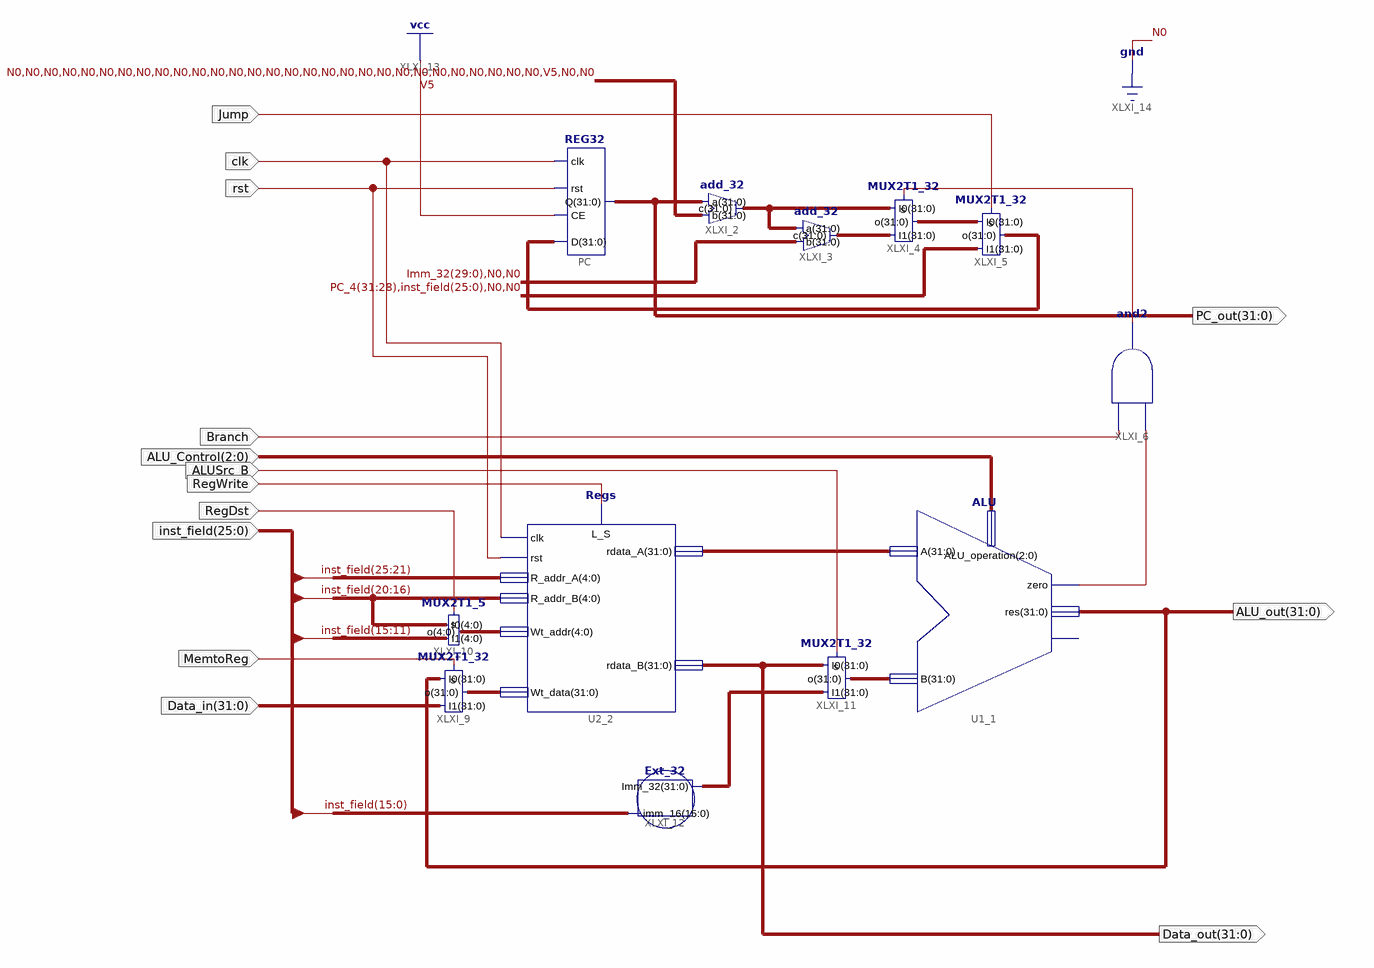
[diagram p0: schematic sheet 1]
// Xilinx ISE schematic Data_path.sch (kintex7) as structural Verilog: 12 symbols, 14 ports
module Data_path (
  input  Jump,
  input  Branch,
  input  [2:0] ALU_Control,
  input  ALUSrc_B,
  input  RegWrite,
  input  [25:0] inst_field,
  input  [31:0] Data_in,
  input  MemtoReg,
  input  RegDst,
  input  clk,
  input  rst,
  output [31:0] PC_out,
  output [31:0] Data_out,
  output [31:0] ALU_out
);

  wire XLXN_18, XLXN_24;
  wire [4:0] XLXN_32;
  wire [31:0] Imm_32, PC_4, XLXN_10, XLXN_12, XLXN_15, XLXN_26, XLXN_28, XLXN_33;

  REG32 PC (.D(XLXN_15), .CE(1'b1), .rst(rst), .clk(clk), .Q(PC_out));
  add_32 XLXI_2 (.c(PC_4), .a(PC_out), .b(32'b00000000000000000000000000000100));
  MUX2T1_32 XLXI_4 (.s(XLXN_18), .I0(PC_4), .I1(XLXN_10), .o(XLXN_12));
  add_32 XLXI_3 (.c(XLXN_10), .a(PC_4), .b({Imm_32[29:0], 2'b00}));
  MUX2T1_32 XLXI_5 (.s(Jump), .I0(XLXN_12), .I1({PC_4[31:28], inst_field, 2'b00}), .o(XLXN_15));
  and XLXI_6 (XLXN_18, XLXN_24, Branch);
  ALU U1_1 (.zero(XLXN_24), .res(ALU_out), .A(XLXN_26), .B(XLXN_28), .ALU_operation(ALU_Control));  // open: overflow
  Regs U2_2 (
    .clk(clk), .L_S(RegWrite), .rdata_A(XLXN_26), .rst(rst), .Wt_data(XLXN_33), .rdata_B(Data_out),
    .R_addr_A(inst_field[25:21]), .R_addr_B(inst_field[20:16]), .Wt_addr(XLXN_32));
  MUX2T1_32 XLXI_11 (.s(ALUSrc_B), .I0(Data_out), .I1(Imm_32), .o(XLXN_28));
  MUX2T1_5 XLXI_10 (.I1(inst_field[15:11]), .I0(inst_field[20:16]), .o(XLXN_32), .s(RegDst));
  MUX2T1_32 XLXI_9 (.s(MemtoReg), .I0(ALU_out), .I1(Data_in), .o(XLXN_33));
  Ext_32 XLXI_12 (.imm_16(inst_field[15:0]), .Imm_32(Imm_32));
endmodule
